# EasyEDA schematic SCH_USB-C PD Decoy Board_2023-05-30.json
REV: 1.0; Sheet: 1/1
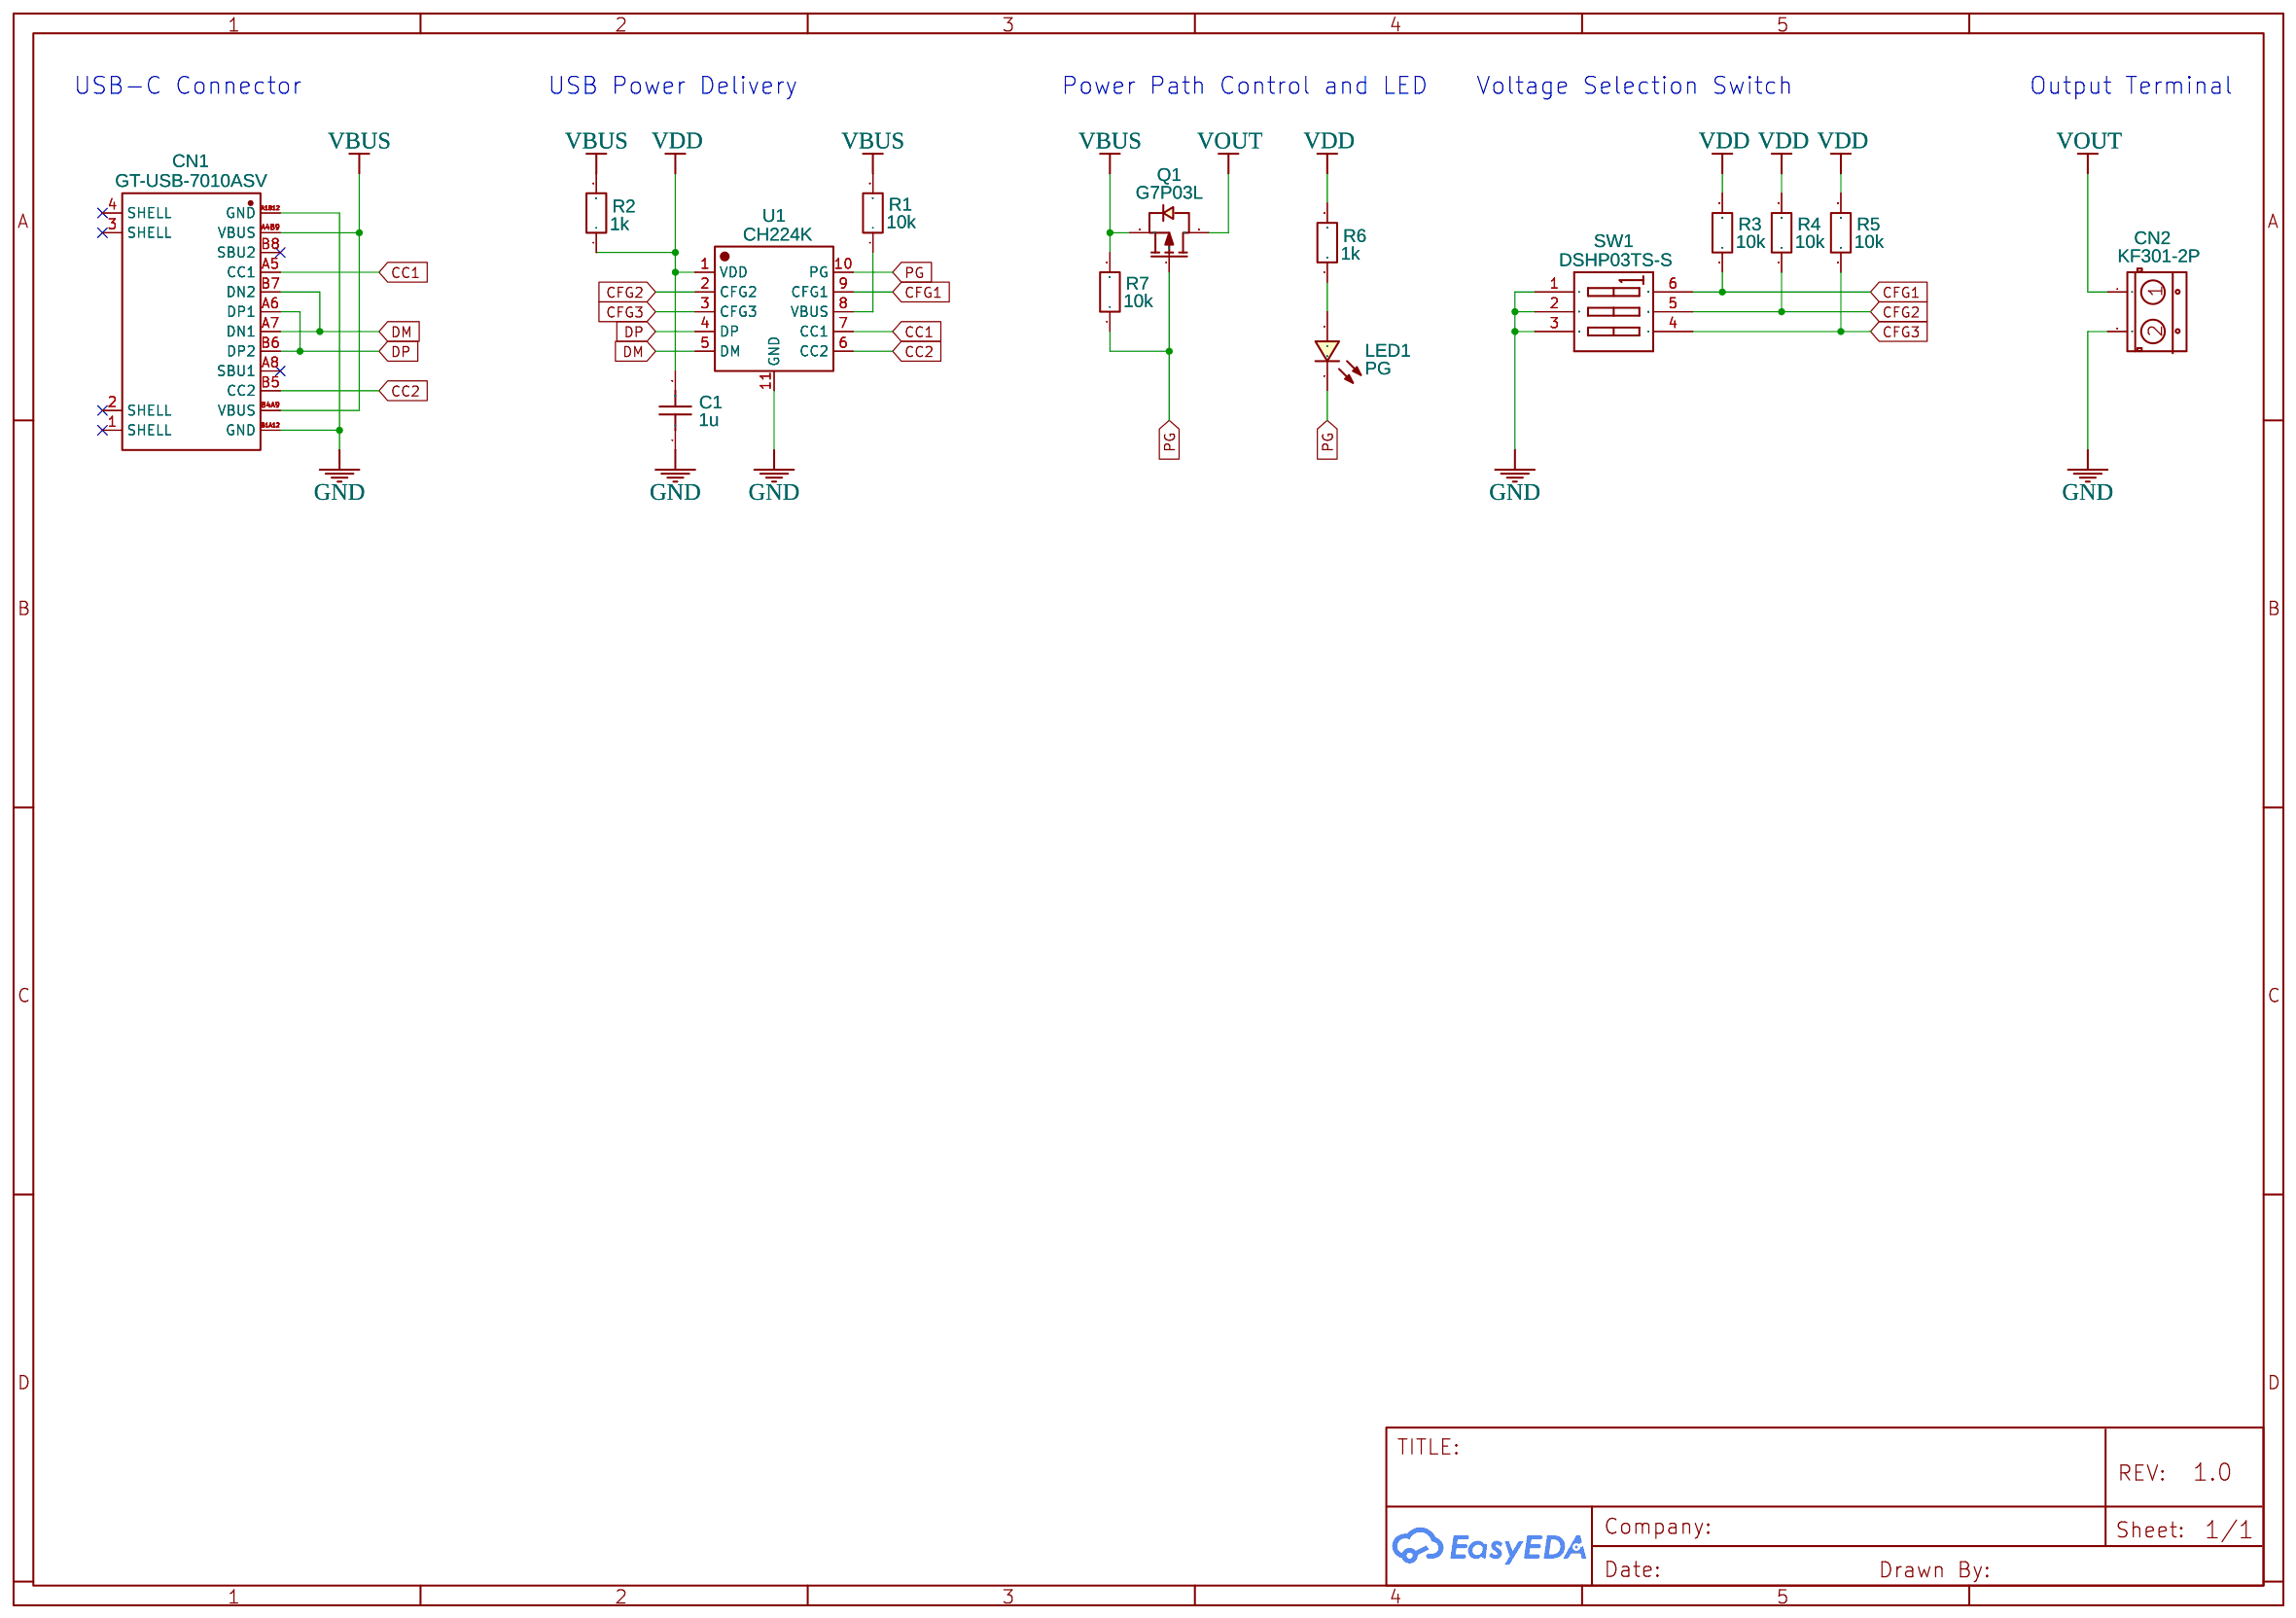
[diagram p0: schematic sheet]

## Parts
C1  1u  [C_0603_S]
CN1  GT-USB-7010ASV  [USB-C-7010ASV]
CN2  KF301-2P  [KF301-2P]
LED1  PG  [LED_0603_S]
Q1  G7P03L  [SOT-23-3_W]
R1  10k  [R_0603_S]
R2  1k  [R_0603_S]
R3  10k  [R_0603_S]
R4  10k  [R_0603_S]
R5  10k  [R_0603_S]
R6  1k  [R_0603_S]
R7  10k  [R_0603_S]
SW1  DSHP03TS-S  [SW-SMD_DIP3]
U1  CH224K  [ESSOP-10-EP]

## Library data of the parts
C1 = CC0603KRX7R9BB104: Supplier: LCSC; Manufacturer: SAMSUNG; Manufacturer Part: CL10A105KB8NNNC; Supplier Part: C15849; JLCPCB Part Class: Basic Part
CN1 = GT-USB-7010ASV: Supplier: LCSC; Supplier Part: C2988369; Manufacturer: G-Switch(品赞); link: https://atta.szlcsc.com/upload/public/pdf/source/20220407/276C2E8CEADC75D1A3BE3EA4074DCCE5.pdf; Contributor: lcsc
CN2 = -: Contributor: vonk0031; sourceId: Z5gQ20Ay7; Manufacturer Part: KF301-5.0-2P; Supplier: LCSC; Manufacturer: Cixi Kefa Elec; Supplier Part: C474881
LED1 = LED-0603-GREEN: Supplier: LCSC; Manufacturer: EVERLIGHT; Manufacturer Part: 19-217/GHC-YR1S2/3T; LCSC Assembly: Yes; image: //image.lceda.cn/szlcsc/C72043.jpg; Supplier Part: C72043; SMT Type: Basic; Contributor: Stefan Wagner
Q1 = G7P03L: Supplier: LCSC; Supplier Part: C840062; Manufacturer: GOFORD; Contributor: LCSC; JLCPCB Part Class: Extended Part
R1 R3-R5 R7 = Res_0603(1/10W)_EU: Manufacturer Part: 0603WAF1002T5E; Supplier: LCSC; Manufacturer: UniOhm; Supplier Part: C25804
R2 R6 = Res_0603(1/10W)_EU: Manufacturer Part: 0603WAF1001T5E; Supplier: LCSC; Manufacturer: UniOhm; Supplier Part: C21190
SW1 = DSHP03TS-S: Supplier: LCSC; Supplier Part: C319051; Manufacturer: XKB Enterprise; Contributor: LCSC; JLCPCB Part Class: Extended Part
U1 = CH224K: Manufacturer: WCH; Contributor: Stefan Wagner

## Nets
GND: C1.1 CN1.A1B12(GND) CN1.B1A12(GND) CN2.2 SW1.1 SW1.2 SW1.3 U1.11(GND)
VBUS: CN1.A4B9(VBUS) CN1.B4A9(VBUS) Q1.2(S) R1.2 R2.2 R7.2
VDD: C1.2 R2.1 R3.2 R4.2 R5.2 R6.2 U1.1(VDD)
CC1: CN1.A5(CC1) U1.7(CC1)
CC2: CN1.B5(CC2) U1.6(CC2)
CFG1: R3.1 SW1.6 U1.9(CFG1)
CFG2: R4.1 SW1.5 U1.2(CFG2)
CFG3: R5.1 SW1.4 U1.3(CFG3)
DM: CN1.A7(DN1) CN1.B7(DN2) U1.5(DM)
DP: CN1.A6(DP1) CN1.B6(DP2) U1.4(DP)
PG: LED1.2(C) Q1.1(G) R7.1 U1.10(PG)
VOUT: CN2.1 Q1.3(D)
Net-(LED1-1): LED1.1(A) R6.1
Net-(R1-1): R1.1 U1.8(VBUS)

Not connected (* = marked no-connect by the designer): CN1 1(SHELL)* 2(SHELL)* 3(SHELL)* 4(SHELL)* A8(SBU1)* B8(SBU2)*

## Notes on the sheet
- USB-C Connector
- USB Power Delivery
- Power Path Control and LED
- Voltage Selection Switch
- Output Terminal
